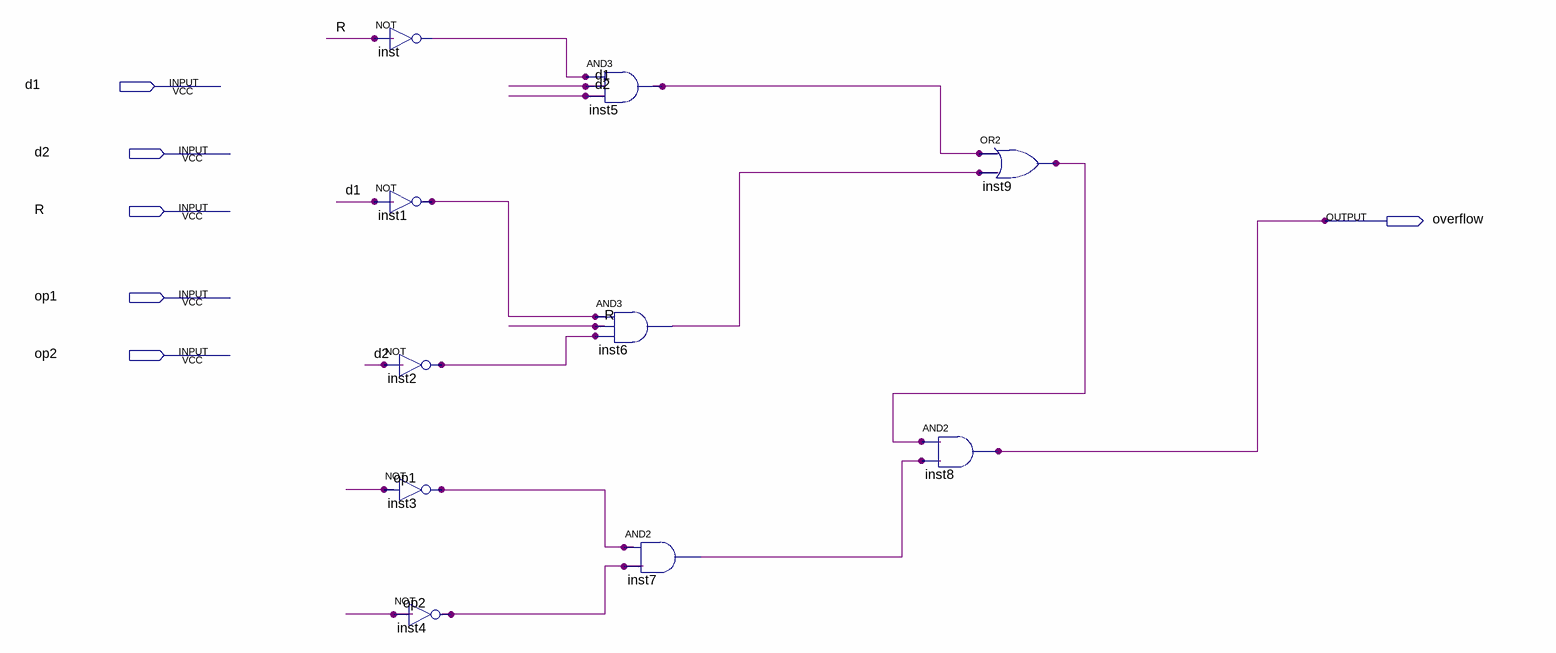
[diagram p0: schematic sheet]
// Quartus schematic overflow_detector.bdf as structural Verilog: 10 symbols, 6 pins
module overflow_detector (
  input  d1,
  input  d2,
  input  R,
  input  op1,
  input  op2,
  output overflow
);

  wire inst1_out, inst2_out, inst3_out, inst4_out, inst5_out, inst6_out, inst7_out, inst9_out, inst_out;

  not inst (inst_out, R);
  not inst1 (inst1_out, d1);
  not inst2 (inst2_out, d2);
  not inst3 (inst3_out, op1);
  not inst4 (inst4_out, op2);
  and inst5 (inst5_out, inst_out, d1, d2);
  and inst6 (inst6_out, inst1_out, R, inst2_out);
  and inst7 (inst7_out, inst3_out, inst4_out);
  or inst9 (inst9_out, inst5_out, inst6_out);
  and inst8 (overflow, inst9_out, inst7_out);
endmodule
